# Altium schematic sheet sch_substrate_board_isp.SchDoc
size A4; SheetNumber: 6; SheetTotal: 6
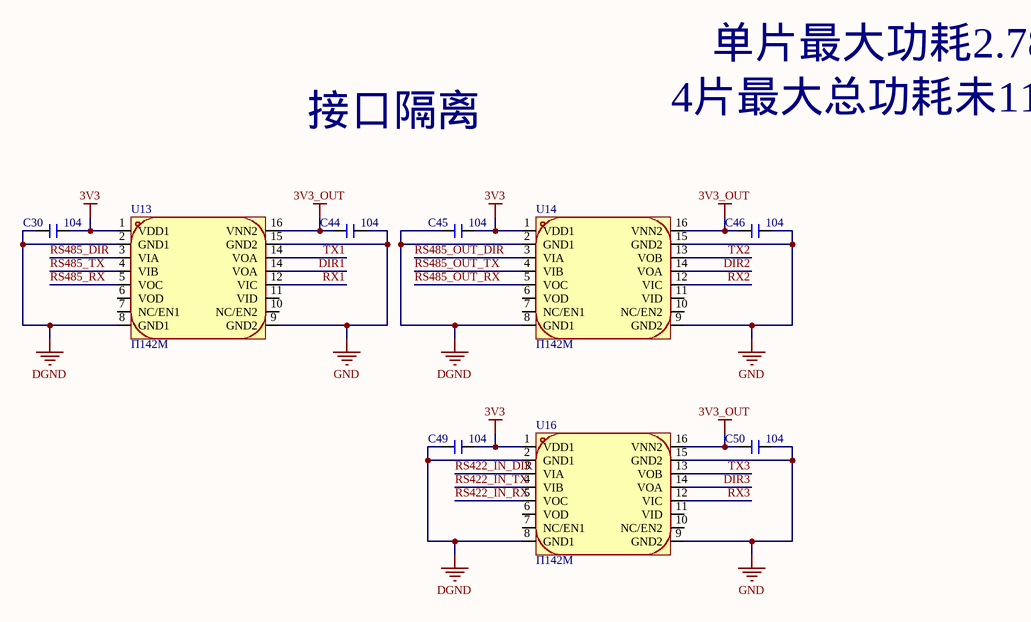
[diagram p0: sch_substrate_board_isp.SchDoc]

## Parts
C30  104  [C 0805_L]
C44  104  [C 0805_L]
C45  104  [C 0805_L]
C46  104  [C 0805_L]
C49  104  [C 0805_L]
C50  104  [C 0805_L]
U13  Π142M  [π120M32]
U14  Π142M  [π120M32]
U16  Π142M  [π120M32]

## Nets
3V3: C30.1 C45.1 C49.1 U13.1(VDD1) U14.1(VDD1) U16.1(VDD1)
3V3_OUT: C44.2 C46.2 C50.2 U13.16(VNN2) U14.16(VNN2) U16.16(VNN2)
DGND: C30.2 C45.2 C49.2 U13.2(GND1) U13.8(GND1) U14.2(GND1) U14.8(GND1) U16.2(GND1) U16.8(GND1)
GND: C44.1 C46.1 C50.1 U13.9(GND2) U13.15(GND2) U14.9(GND2) U14.15(GND2) U16.9(GND2) U16.15(GND2)
DIR1: U13.14(VOA)
DIR2: U14.14(VOA)
DIR3: U16.14(VOA)
RS422_IN_DIR: U16.3(VIA)
RS422_IN_RX: U16.5(VOC)
RS422_IN_TX: U16.4(VIB)
RS485_DIR: U13.3(VIA)
RS485_OUT_DIR: U14.3(VIA)
RS485_OUT_RX: U14.5(VOC)
RS485_OUT_TX: U14.4(VIB)
RS485_RX: U13.5(VOC)
RS485_TX: U13.4(VIB)
RX1: U13.12(VIC)
RX2: U14.12(VIC)
RX3: U16.12(VIC)
TX1: U13.14(VOA)
TX2: U14.13(VOB)
TX3: U16.13(VOB)

Not connected (* = marked no-connect by the designer): U13 6(VOD) 7(NC/EN1) 10(NC/EN2) 11(VID); U14 6(VOD) 7(NC/EN1) 10(NC/EN2) 11(VID); U16 6(VOD) 7(NC/EN1) 10(NC/EN2) 11(VID)

## Notes on the sheet
- 4片最大总功耗未11.12W
- 单片最大功耗2.78W
- 接口隔离

## Library data of the parts
C30 C44-C46 C49 C50 = C: 贴片电容; BOM名称: 无极性贴片电容; 淘宝ID: 封装库来自淘宝 ID：黄晶宝石; 联系售后，技术支持: https://shop463601444.taobao.com; 唯一出售店铺网址: https://shop463601444.taobao.com
U13 U14 U16 = Π142M: 数字隔离器